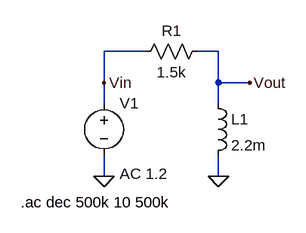
[diagram p0: schematic 6-2.asc]
6-2.asc, the LTspice schematic file:
Version 4
SHEET 1 880 680
WIRE 128 32 64 32
WIRE 240 32 208 32
WIRE 64 80 64 32
WIRE 240 80 240 32
WIRE 288 80 240 80
WIRE 64 112 64 80
WIRE 240 112 240 80
WIRE 64 224 64 192
WIRE 240 224 240 192
FLAG 240 224 0
FLAG 64 224 0
FLAG 288 80 Vout
FLAG 64 80 Vin
SYMBOL ind 224 96 R0
SYMATTR InstName L1
SYMATTR Value 2.2m
SYMBOL voltage 64 96 R0
WINDOW 123 24 124 Left 2
WINDOW 39 0 0 Left 0
SYMATTR Value2 AC 1.2
SYMATTR InstName V1
SYMATTR Value ""
SYMBOL res 224 16 R90
WINDOW 0 0 56 VBottom 2
WINDOW 3 32 56 VTop 2
SYMATTR InstName R1
SYMATTR Value 1.5k
TEXT -64 264 Left 2 !.ac dec 500k 10 500k

The netlist it stands for:
* 6-2.asc
L1 Vout 0 2.2m
V1 Vin 0 AC 1.2
R1 Vout Vin 1.5k
.ac dec 500k 10 500k
.backanno
.end